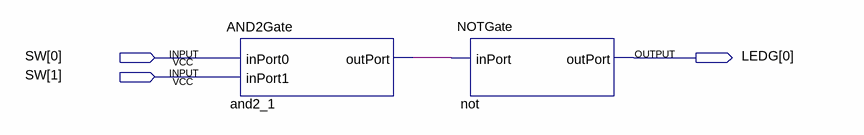
[diagram p0: schematic sheet]
// Quartus schematic NANDGate.bdf as structural Verilog: 2 symbols, 3 pins
module NANDGate (
  input  [1:0] SW,
  output [0:0] LEDG
);

  wire and2_1_outport;

  AND2Gate and2_1 (.inPort0(SW[0]), .inPort1(SW[1]), .outPort(and2_1_outport));
  NOTGate \not  (.inPort(and2_1_outport), .outPort(LEDG[0]));
endmodule
